# Altium schematic sheet rs_connection.SchDoc
size A4
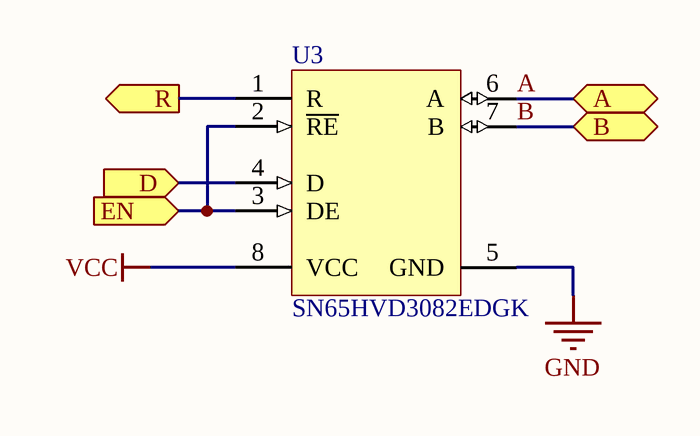
[diagram p0: rs_connection.SchDoc]

## Parts
U3  SN65HVD3082EDGK  [DGK8_L]

## Ports
A (bidir), B (bidir), D (in), EN (in), R (out)

## Nets
GND: U3.5(GND)
VCC: U3.8(VCC)
A: U3.6(A) ; port A
B: U3.7(B) ; port B
D: U3.4(D) ; port D
EN: U3.2(~{RE}) U3.3(DE) ; port EN
R: U3.1(R) ; port R

## Library data of the parts
U3 = SN65HVD3082EDGK: Low-Power RS-485 Transceiver, 0.2 Mbps, 5 V, Half Duplex, -40 to 85 degC, 8-pin MSOP (DGK), Green (RoHS & no Sb/Br); Manufacturer: Texas Instruments; # of TX/RX: 1 TX / 1 RX; Drivers Per Package: 1; Number of Nodes: 256; Signaling Rate(Mbps): 0.2; Common Mode Range: -7 to 12; ESD(kV): 15; Fault Protection(V): -9 to 14; Fail Safe: Idle, Open, Short; ICC(Max)(mA): 0.9; Supply Voltage(s)(V): 5; Rating: Catalog; DatasheetVersion: SLLS562G; PackageVersion: revE, May-2006; PackageReference: DGK8; PackageDescription: 8-Pin Thin Small Outline Package 3 x 3 mm Body ,0.65 mm Pitch; Supplier 1: Digi-Key; Supplier Part Number 1: 296-17929-ND; Supplier 2: Newark; Supplier Part Number 2: 01J0699; Supplier 3: Mouser; Supplier Part Number 3: 595-SN65HVD3082EDGK; Eco-Plan: Green (RoHS & no Sb/Br); SubFamily: RS-485; Receivers Per Package: 1; Isolated: No; Duplex: Half; Footprint: SN75176; Mounting Technology: Surface Mount; PartNumber: SN65HVD3082EDGK; Code_JEDEC: MO-187-AA; ComponentLink1Description: Datasheet; ComponentLink1URL: http://www.ti.com/general/docs/lit/getliterature.tsp?genericPartNumber=SN65HVD3082E&fileType=pdf; ComponentLink2Description: Package Specification; ComponentLink2URL: http://www.ti.com/litv/pdf/msoi002j